# Altium project Holder_Accu_Simetric.PrjPcb
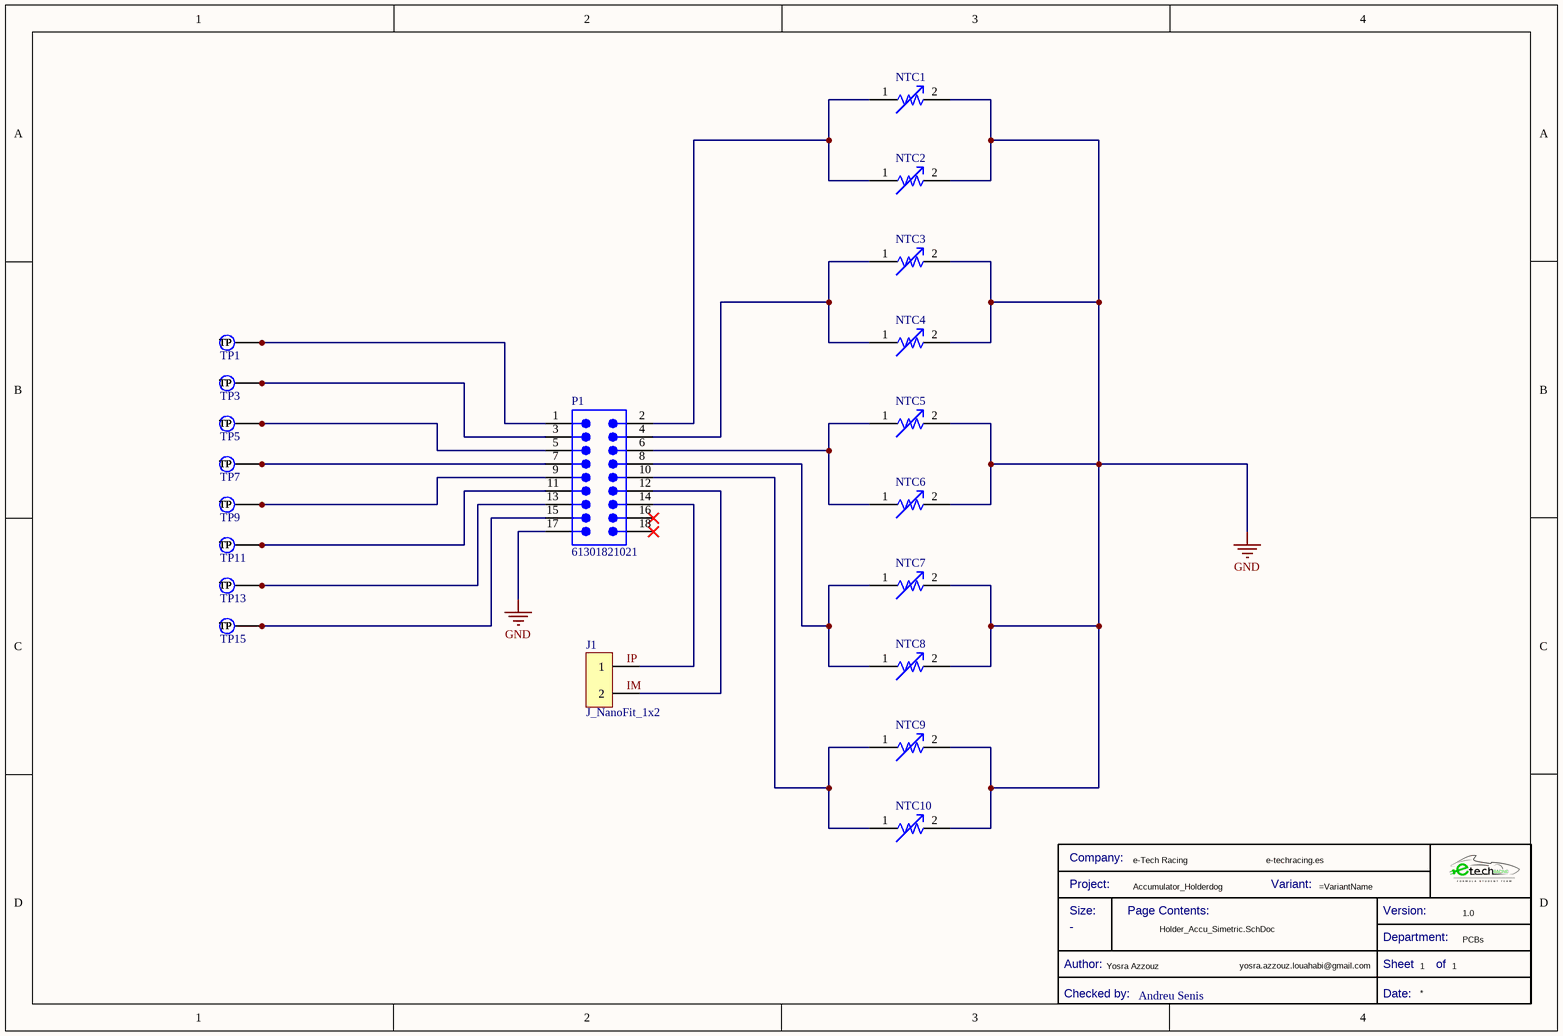
[diagram p0: Holder_Accu_Simetric.SchDoc]
Version: 1.0; ReviewerName: Andreu Senis; Project: Accumulator_Holderdog; DesignerName: Yosra Azzouz; DesignerMail: yosra.azzouz.louahabi@gmail.com; DesignedByURL: e-techracing.es; Department: PCBs; Company: e-Tech Racing
1 sheet, 21 parts. Net scope: global (net labels, ports and power ports of the same name join across sheets).
Board file: HolderDog_Simetric.PcbDoc

## Sheet Holder_Accu_Simetric.SchDoc
size A4; SheetNumber: 1; SheetTotal: 1

### Parts
*  Checked by:: Andreu Senis  (hidden comment: Title Block_template)  (graphical)
J1  J_NanoFit_1x2  [FP-105309-1102-MFG]
NTC1  NTC SMD 0805  [RESC2012X10N]  (value not drawn)
NTC2  NTC SMD 0805  [RESC2012X10N]  (value not drawn)
NTC3  NTC SMD 0805  [RESC2012X10N]  (value not drawn)
NTC4  NTC SMD 0805  [RESC2012X10N]  (value not drawn)
NTC5  NTC SMD 0805  [RESC2012X10N]  (value not drawn)
NTC6  NTC SMD 0805  [RESC2012X10N]  (value not drawn)
NTC7  NTC SMD 0805  [RESC2012X10N]  (value not drawn)
NTC8  NTC SMD 0805  [RESC2012X10N]  (value not drawn)
NTC9  NTC SMD 0805  [RESC2012X10N]  (value not drawn)
NTC10  NTC SMD 0805  [RESC2012X10N]  (value not drawn)
P1  61301821021  [61301821021]
TP1  Test Point  [TESTPOINT_WIDE]  (value not drawn)
TP3  Test Point  [TESTPOINT_WIDE]  (value not drawn)
TP5  Test Point  [TESTPOINT_WIDE]  (value not drawn)
TP7  Test Point  [TESTPOINT_WIDE]  (value not drawn)
TP9  Test Point  [TESTPOINT_WIDE]  (value not drawn)
TP11  Test Point  [TESTPOINT_WIDE]  (value not drawn)
TP13  Test Point  [TESTPOINT_WIDE]  (value not drawn)
TP15  Test Point  [TESTPOINT_WIDE]  (value not drawn)

### Nets
GND: NTC1.2 NTC2.2 NTC3.2 NTC4.2 NTC5.2 NTC6.2 NTC7.2 NTC8.2 NTC9.2 NTC10.2 P1.17
NetJ1_1: J1.1 P1.14
NetJ1_2: J1.2 P1.12
NetNTC1_1: NTC1.1 NTC2.1 P1.2
NetNTC3_1: NTC3.1 NTC4.1 P1.4
NetNTC5_1: NTC5.1 NTC6.1 P1.6
NetNTC7_1: NTC7.1 NTC8.1 P1.8
NetNTC9_1: NTC9.1 NTC10.1 P1.10
NetP1_1: P1.1 TP1.1(TP)
NetP1_3: P1.3 TP3.1(TP)
NetP1_5: P1.5 TP5.1(TP)
NetP1_7: P1.7 TP7.1(TP)
NetP1_9: P1.9 TP9.1(TP)
NetP1_11: P1.11 TP11.1(TP)
NetP1_13: P1.13 TP13.1(TP)
NetP1_15: P1.15 TP15.1(TP)

Not connected (* = marked no-connect by the designer): P1 16* 18*

### Notes on the sheet
- Labels drawn without touching a wire or pin: IM, IP
- (in symbol Title Block_template) Company:; Project:; Variant:; Size:; Page Contents:; Version:; Department:; Author:; Sheet; of; Checked by:; Date:

### Library data of the parts
* = Title Block_template: Standard Title Block; .Creator: GP; Category: Title Block; .PCBcheck: GP; .SCHcheck: GP; Size: -
J1 = CMP-002-00001-2: Conn HDR 2 POS 2.5mm Solder ST Thru-Hole 2 Terminal 1 Port Nano-Fit Tray
NTC1-NTC10 = CMP-010-00001-1: NTC 0805 package 10kR
P1 = CMP-002-00004-1: Board Connector, 18 Contact(s), 2 Row(s), Male, Right Angle, 0.1 inch Pitch, Solder Terminal, Locking, Black Insulator, Plug; RoHS Compliant: Yes; Mounting Technology: Board; Min Operating Temperature: -40°C; Connector Type: BOARD CONNECTOR; Max Operating Temperature: 125°C
TP1 TP3 TP5 TP7 TP9 TP11 TP13 TP15 = TestPoint_Wide: TestPoint 5x5mm